# Altium schematic sheet ZOWI_Main_Board_USB.SchDoc: USB
size A4; Date: 20140214; Author: Raúl de Pablos; CompanyName: bq - Mundo Reader; Organization: bq - Mundo Reader; DocumentNumber: 6; Revision: 1.0; SheetNumber: 6; SheetTotal: 9; ProjectName: ZOWI_Main_Board
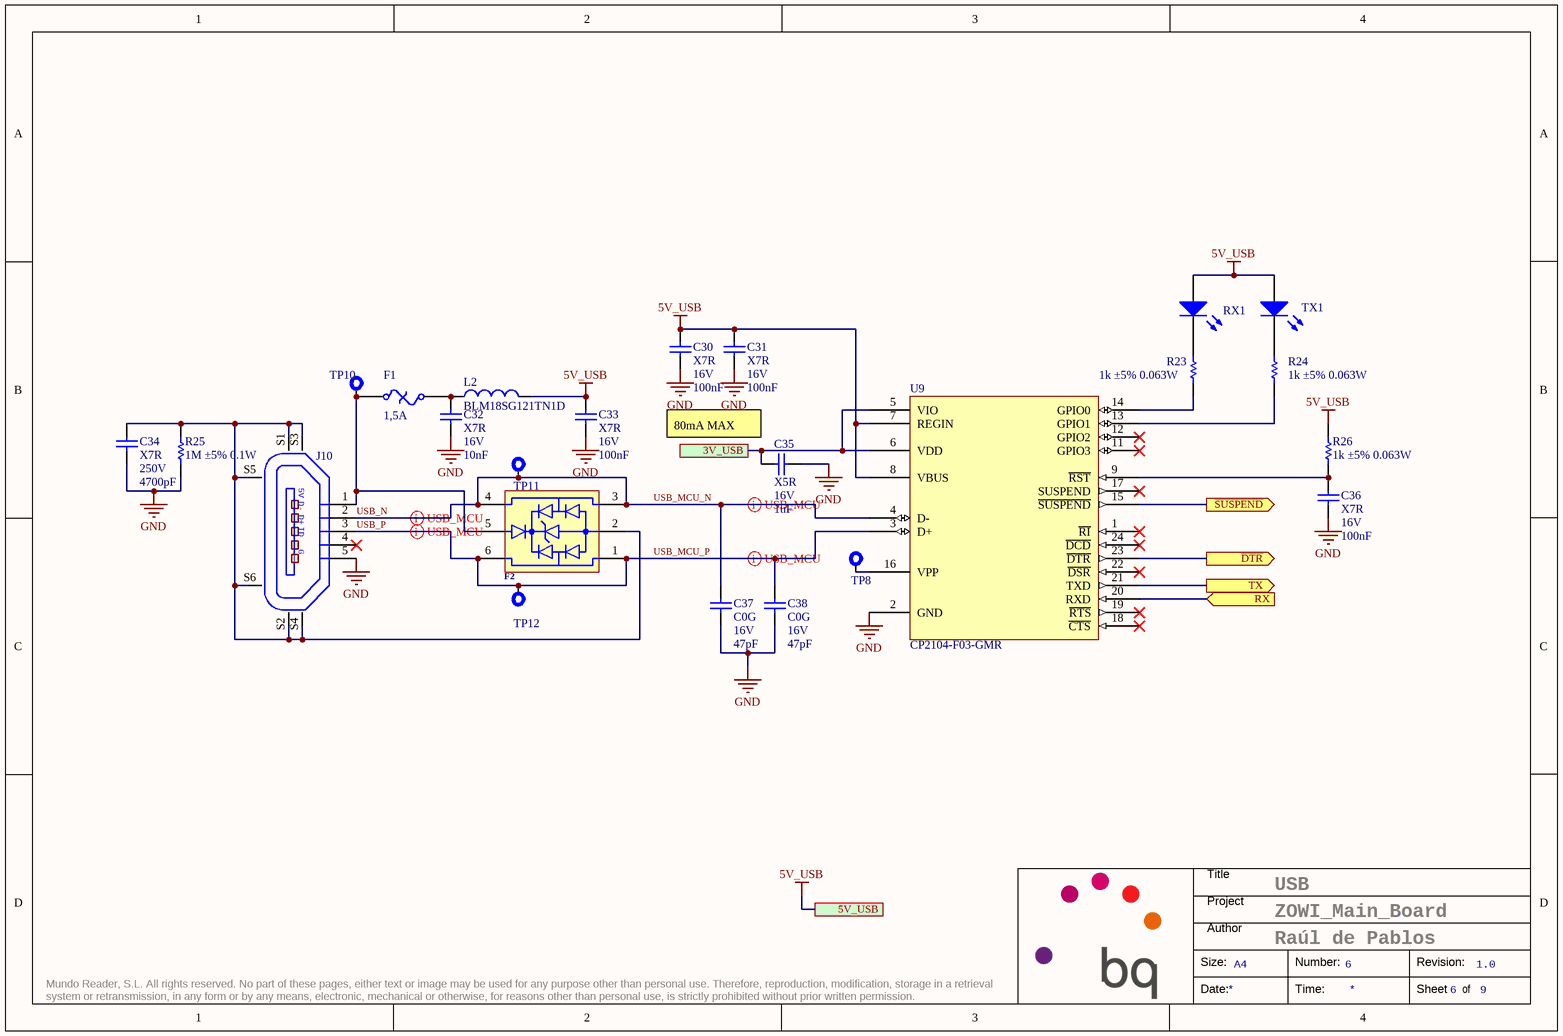
[diagram p0: ZOWI_Main_Board_USB.SchDoc]

## Parts
C30  Dielectric: X7R  Voltage: 16V  Capacitance: 100nF  [C0402]  (hidden comment: Capacitor)
C31  Dielectric: X7R  Voltage: 16V  Capacitance: 100nF  [C0402]  (hidden comment: Capacitor)
C32  Dielectric: X7R  Voltage: 16V  Capacitance: 10nF  [C0402]  (hidden comment: Capacitor)
C33  Dielectric: X7R  Voltage: 16V  Capacitance: 100nF  [C0402]  (hidden comment: Capacitor)
C34  Dielectric: X7R  Voltage: 250V  Capacitance: 4700pF  [C0805]  (hidden comment: Capacitor)
C35  Dielectric: X5R  Voltage: 16V  Capacitance: 1uF  [C0603]  (hidden comment: Capacitor)
C36  Dielectric: X7R  Voltage: 16V  Capacitance: 100nF  [C0402]  (hidden comment: Capacitor)
C37  Dielectric: C0G  Voltage: 16V  Capacitance: 47pF  [C0402]  (hidden comment: Capacitor)
C38  Dielectric: C0G  Voltage: 16V  Capacitance: 47pF  [C0402]  (hidden comment: Capacitor)
F1  Current: 1,5A  [F1812]  (hidden comment: PTC_Fuse)
F2  ESDUSB  [SOT563]  (value not drawn)
J10  USB_Micro_Type_B  [USB_B_W_REAR_PEGS]  (value not drawn)
L2  BLM18SG121TN1D  [L0603]
R23  value 1k ±5% 0.063W  [R0402]  (hidden comment: Resistor)
R24  value 1k ±5% 0.063W  [R0402]  (hidden comment: Resistor)
R25  value 1M ±5% 0.1W  [R0603]  (hidden comment: Resistor)
R26  value 1k ±5% 0.063W  [R0402]  (hidden comment: Resistor)
RX1  Green  [LED0603]  (value not drawn)
TP8  Testpoint  [TP_SMD_1mm]  (value not drawn)  (no BOM)
TP10  Testpoint  [TP_SMD_1mm]  (value not drawn)  (no BOM)
TP11  Testpoint  [TP_SMD_1mm]  (value not drawn)  (no BOM)
TP12  Testpoint  [TP_SMD_1mm]  (value not drawn)  (no BOM)
TX1  Green  [LED0603]  (value not drawn)
U9  CP2104-F03-GMR  [QFN24]

## Ports
3V_USB, 5V_USB, RX (in), TX (out), ~{DTR} (out), ~{SUSPEND} (out)

## Nets
5V_USB: C30.2 C31.2 C33.2 L2.2 R26.2 RX1.A TX1.A U9.7(REGIN) U9.8(VBUS) ; port 5V_USB
GND: C30.1 C31.1 C32.1 C33.1 C34.1 C35.1 C36.1 C37.1 C38.1 J10.5(P5) R25.1 U9.2(GND)
3V_USB: C35.2 U9.5(VIO) U9.6(VDD) ; port 3V_USB
~{DTR}: U9.23(~{DTR}) ; port ~{DTR}
RX: U9.20(RXD) ; port RX
~{SUSPEND}: U9.15(~{SUSPEND}) ; port ~{SUSPEND}
TX: U9.21(TXD) ; port TX
USB_MCU_N: C37.2 F2.3 F2.4 J10.2(P2) TP11.1 U9.4(D-)  [also labelled USB_N]
USB_MCU_P: C38.2 F2.1 F2.6 J10.3(P3) TP12.1 U9.3(D+)  [also labelled USB_P]
NetC32_2: C32.2 F1.2 L2.1
NetC34_2: C34.2 F2.2 J10.S1(SHLD1) J10.S2(SHLD2) J10.S3(SHLD3) J10.S4(SHLD4) J10.S5(SHLD5) J10.S6(SHLD6) R25.2
NetC36_2: C36.2 R26.1 U9.9(~{RST})
NetF1_1: F1.1 F2.5 J10.1(P1) TP10.1
NetR23_1: R23.1 U9.14(GPIO0)
NetR23_2: R23.2 RX1.K
NetR24_1: R24.1 U9.13(GPIO1)
NetR24_2: R24.2 TX1.K
NetTP8_1: TP8.1 U9.16(VPP)

Not connected (* = marked no-connect by the designer): J10 4(P4)*; U9 1(~{RI})* 11(GPIO3)* 12(GPIO2)* 17(SUSPEND)* 18(~{CTS})* 19(~{RTS})* 22(~{DSR})* 24(~{DCD})*

## Layout directives
differential pair: USB_MCU_N, USB_MCU_P

## Notes on the sheet
- (near C35) 80mA MAX
- Title
- Project
- Size:
- Author
- A4
- Number:
- Revision:
- Mundo Reader, S.L. All rights reserved. No part of these pages, either text or image may be used for any purpose other than personal use. Therefore, reproduction, modification, storage in a retrieval system or retransmission, in any form or by any means, electronic, mechanical or otherwise, for reasons other than personal use, is strictly prohibited without prior written permission.
- Date:
- Time:
- Sheet
- of
- (in symbol Micro USB Type B W/ Rear Pegs) 5V; D-; D+; ID; G

## Library data of the parts
C30 C31 C33 C36 = C0402_100nF_16V_±10%: Capacitor SMD; Manufacturer: Kemet; Value: 100nF ±10% 16V; Tolerance: ±10%; OrderingCode: C0402C104K4RAC; Temp_ Max: 125; Temp_ Min: -55; Part Number: C0402_100nF_16V_±10%
C32 = C0402_10nF_16V_±10%: Capacitor SMD; Manufacturer: Kemet; Value: 10nF ±10% 16V; Tolerance: ±10%; OrderingCode: C0402C103K4RAC; Temp_ Max: 125; Temp_ Min: -55; Part Number: C0402_10nF_16V_±10%
C34 = C0805_4700pF_250V_±10%: Capacitor SMD; Manufacturer: TDK; Value: 4700pF ±10% 250V; Tolerance: ±10%; OrderingCode: C2012X7R2E472K085AM; Temp_ Max: 125; Temp_ Min: -55; Part Number: C0805_4700pF_250V_±10%
C35 = C0603_1uF_16V_±10%: Capacitor SMD; Manufacturer: Kemet; Value: 1uF ±10% 16V; Tolerance: ±10%; OrderingCode: C0603C105K4PAC; Temp_ Max: 125; Temp_ Min: -55; Part Number: C0603_1uF_16V_±10%
C37 C38 = C0402_47pF_16V_±10%: Capacitor SMD; Manufacturer: Kemet; Value: 47pF ±10% 16V; Tolerance: ±10%; OrderingCode: C0402C470K4GAC; Temp_ Max: 125; Temp_ Min: -55; Part Number: C0402_47pF_16V_±10%
F1 = FUSE 1.5A 24V: Protection, PTC Resettable Fuse; Manufacturer: Bourns; Voltage: 24V; OrderingCode: MF-MSMF150/24X; Temp_ Max: 85; Temp_ Min: -40; Part Number: FUSE 1.5A 24V
F2 = USB ESD Single: Protection, USB ESD; Manufacturer: Würth; OrderingCode: 82400152; Temp_ Max: 125; Temp_ Min: -40; OrderingCode 2: CDSOT563-0502; Part Number: USB ESD Single; Manufacturer 2: Bourns
J10 = Micro USB Type B W/ Rear Pegs: Connector, USB Micro B; Manufacturer: FCI; OrderingCode: 10118194-0001LF; Temp_ Max: 105; Temp_ Min: -40; Part Number: Micro USB Type B W/ Rear Pegs
L2 = L0603_120R_0,025R_3000mA: Ferrite Bead; Manufacturer: Murata; Resistance_100MHz: 120R; Resistance_DC: 0,025R; Current: 3000mA; Temp_ Max: 125; Temp_ Min: -55; Value: 120R 0,025R 3000mA; Part Number: L0603_120R_0,025R_3000mA; OrderingCode: BLM18SG121TN1D
R23 R24 R26 = R0402_1k_0.063W_±5%: Resistor, SMD; Manufacturer: Vishay; Tolerance: ±5%; OrderingCode: CRCW04021K00JN; Power: 0.063W; Resistance: 1k; Temp_ Max: 155; Temp_ Min: -55; PackageDescription: SMD; Part Number: R0402_1k_0.063W_±5%
R25 = R0603_1M_0.1W_±5%: Resistor, SMD; Manufacturer: Vishay; Tolerance: ±5%; OrderingCode: CRCW06031M00JN; Power: 0.1W; Resistance: 1M; Temp_ Max: 155; Temp_ Min: -55; PackageDescription: SMD; Part Number: R0603_1M_0.1W_±5%
RX1 TX1 = HSMG-C190: LED; Manufacturer: Avago Technologies; Temp_ Max: 85; Temp_ Min: -40; OrderingCode 2: LG Q971-KN-1; Part Number: HSMG-C190; OrderingCode: HSMG-C190; Manufacturer 2: OSRAM Opto; Value: Green
TP8 TP10-TP12 = TP_SMD_1mm: Manufacturer: Oxley; OrderingCode: SMOX/060/B1; SAP: 303552; Part Number: TP_SMD_1mm
U9 = CP2104: USB to UART Transceiver; Manufacturer: Silicon Labs; Temp_ Max: 85; Temp_ Min: -40; Part Number: CP2104; OrderingCode: CP2104-F03-GMR